# Altium schematic sheet BQ2571x_reference.SchDoc: Title
size C; Engineer: Craig Wenger (cwenger@eesaz.com); Organization: Altium Limited; Address1: L3, 12a Rodborough Rd; Address2: Frenchs Forest; Address3: NSW; Address4: Australia 2086; DocumentNumber: Document Number; Revision: Rev; SheetNumber: X; SheetTotal: Y; ProjectName: Project Name
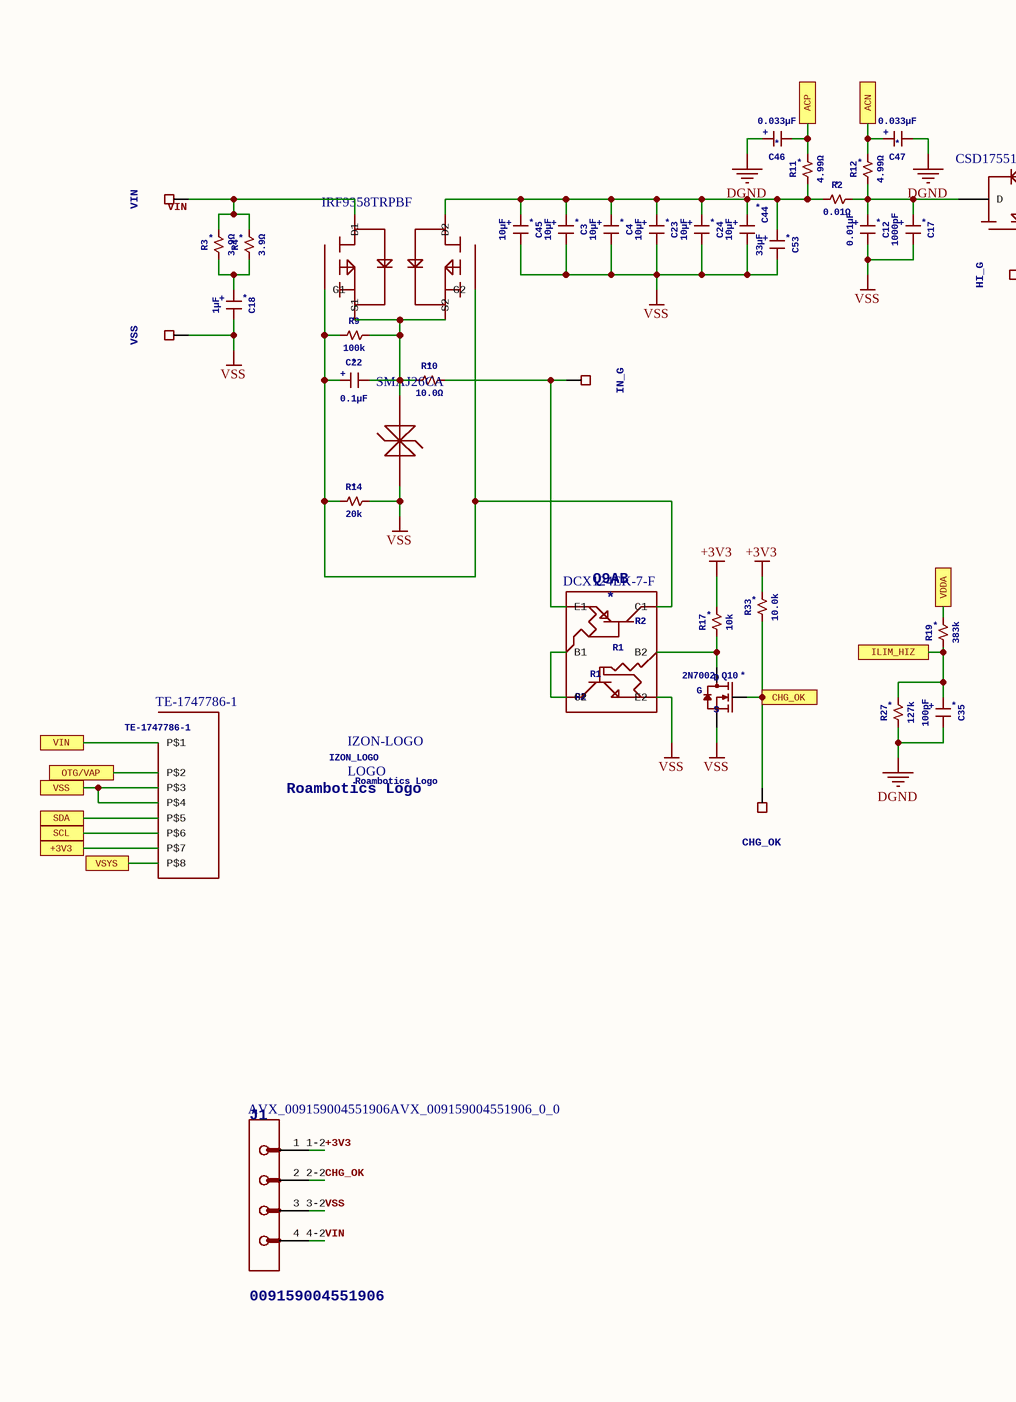
[diagram p0: BQ2571x_reference.SchDoc, left]
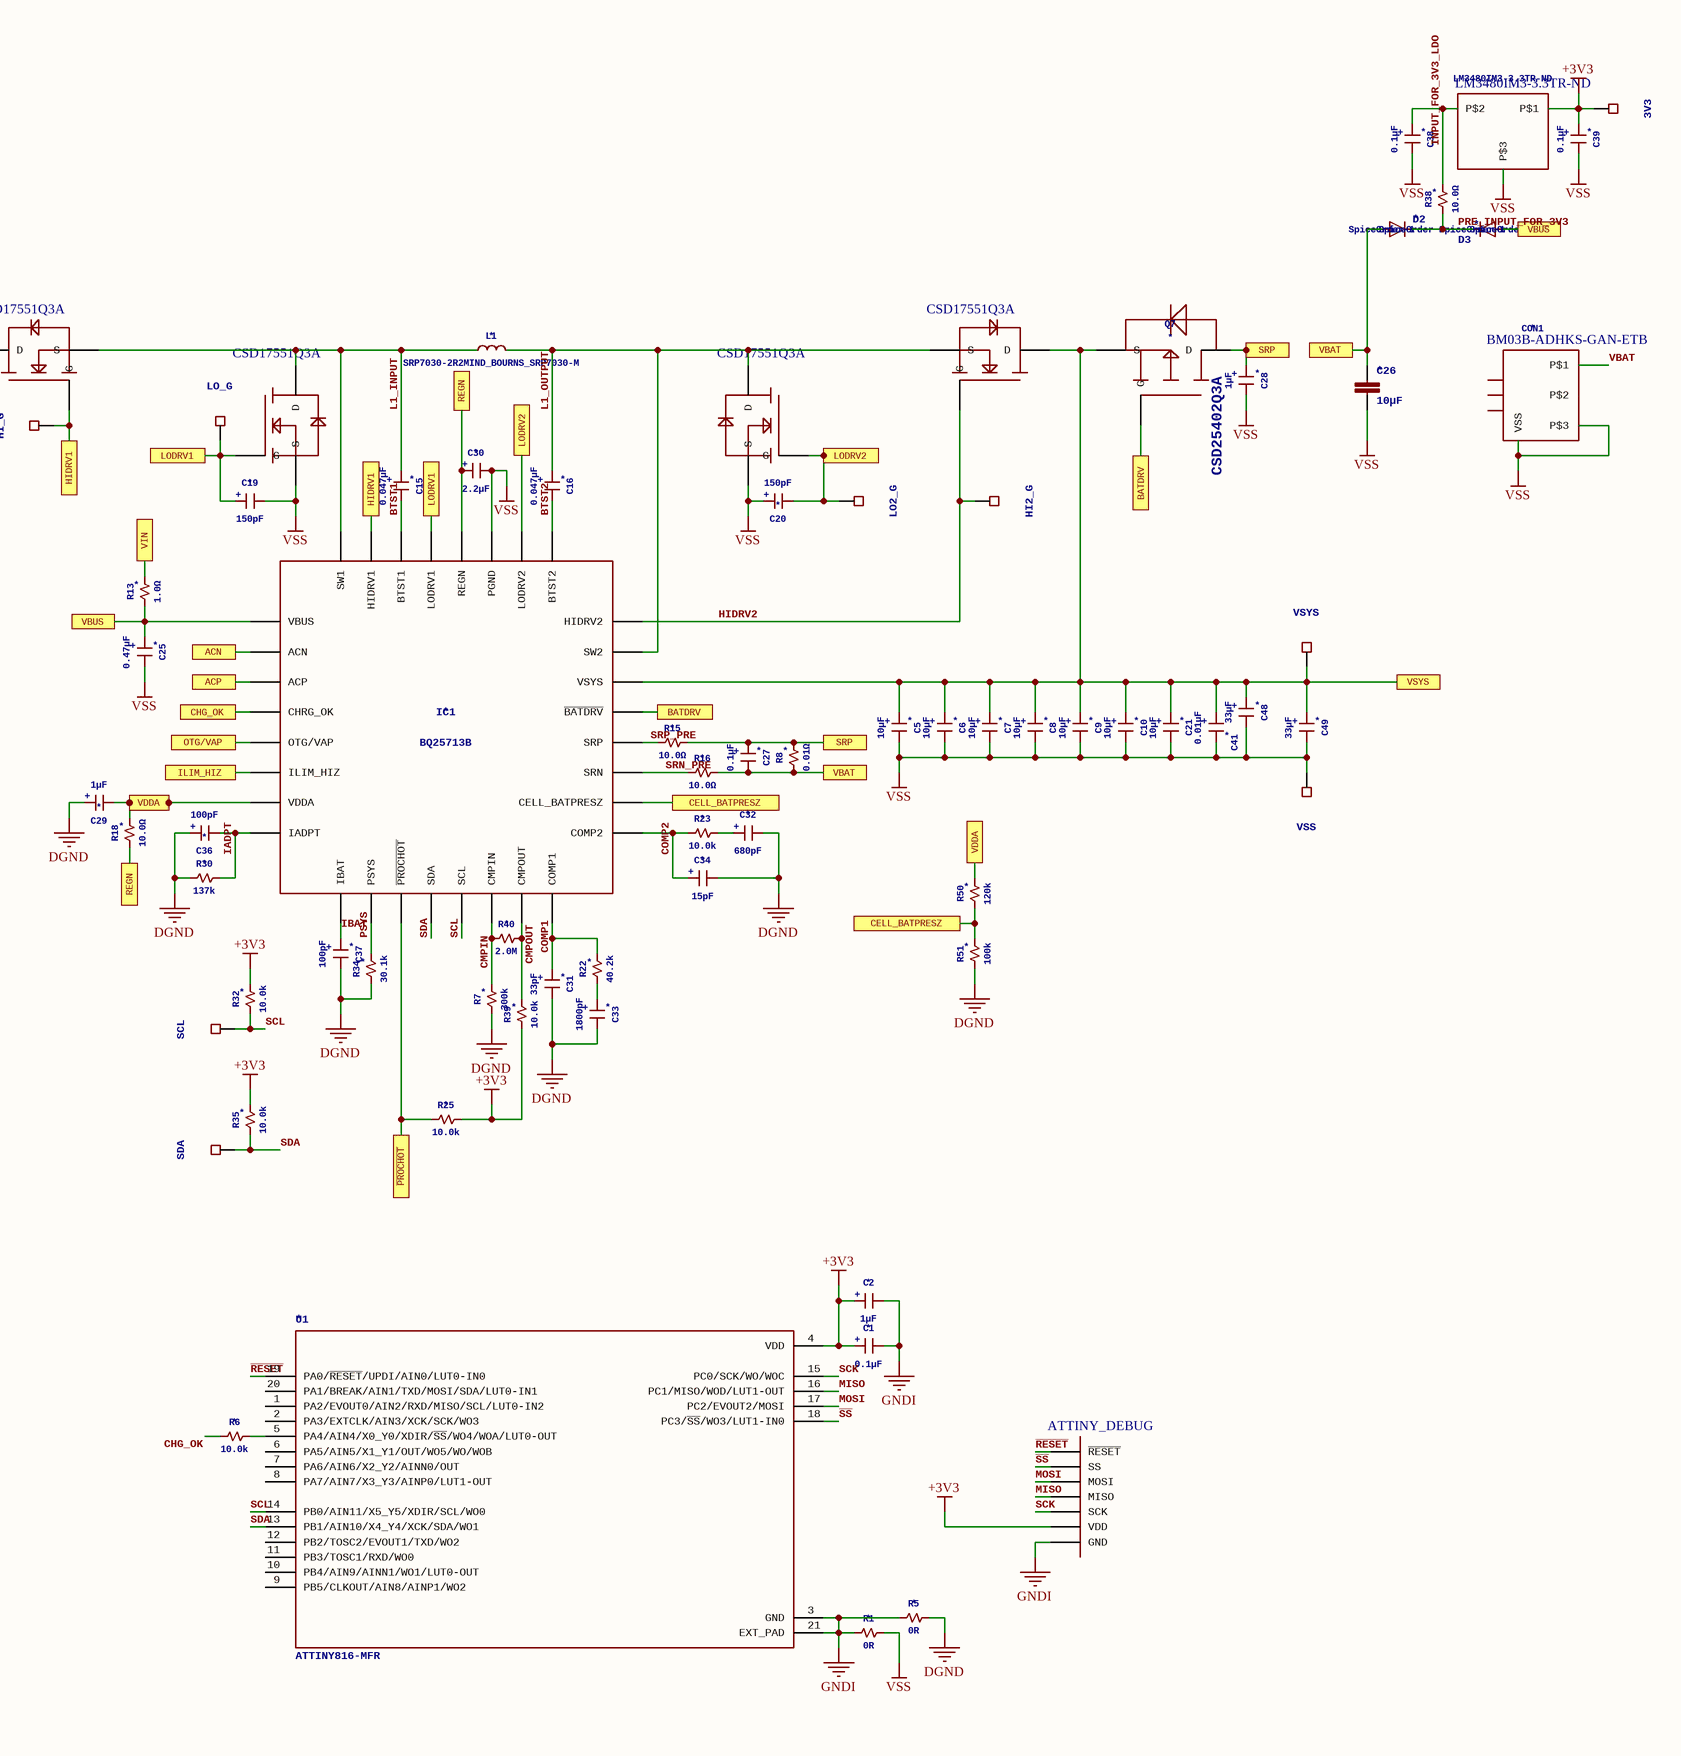
[diagram p1: BQ2571x_reference.SchDoc, right]

## Parts
C1  0.1µF  [0603]
C2  1µF  [0603]
C3  10µF  [0805]
C4  10µF  [0805]
C5  10µF  [0805]
C6  10µF  [0805]
C7  10µF  [0805]
C8  10µF  [0805]
C9  10µF  [0805]
C10  10µF  [0805]
C12  0.01µF  [0603]
C15  0.047µF  [0603]
C16  0.047µF  [0603]
C17  1000pF  [0402]
C18  1µF  [0603]
C19  150pF  [0603]
C20  150pF  [0603]
C21  10µF  [0805]
C22  0.1µF  [0603]
C23  10µF  [0805]
C24  10µF  [0805]
C25  0.47µF  [0805]
C26  10µF  [C1206]
C27  0.1µF  [0603]
C28  1µF  [0603]
C29  1µF  [0603]
C30  2.2µF  [0603]
C31  33pF  [0402]
C32  680pF  [0402]
C33  1800pF  [0402]
C34  15pF  [0402]
C35  100pF  [0603]
C36  100pF  [0603]
C37  100pF  [0603]
C38  0.1µF  [0603]
C39  0.1µF  [0603]
C41  0.01µF  [0603]
C44  10µF  [0805]
C45  10µF  [0805]
C46  0.033µF  [0603]
C47  0.033µF  [0603]
C48  33µF  [1206]
C49  33µF  [1206]
C53  33µF  [1206]
CON1  BM03B-ADHKS-GAN-ETB  [BM03B-ADHKS-GAN-ETB]
CON8  TE-1747786-1  [TE-1747786-1]
D1  SMAJ26CA  [DO-214AC]
D2  SpiceOrder1: SpiceOrder 1  SpiceOrder2: SpiceOrder 2  [SOD323-R]  (hidden comment: DIODE-SOD323-R)
D3  SpiceOrder1: SpiceOrder 1  SpiceOrder2: SpiceOrder 2  [SOD323-R]  (hidden comment: DIODE-SOD323-R)
IC1  BQ25713B  [S-PWQFN-N32]
J1  AVX_009159004551906AVX_009159004551906_0_0  [AVX_009159004551906_0]
L1  SRP7030-2R2MIND_BOURNS_SRP7030-M  [IND_BOURNS_SRP7030-M]
LOGO1  LOGO  RoamboticsLogo: Roambotics Logo  [LOGO]
LOGO4  IZON-LOGO  [IZON_LOGO]
PAD1  3V3  [PAD]
PAD2  VIN  [PAD]
PAD3  VSS  [PAD]
PAD4  CHG_OK  [PAD]
PAD5  SCL  [PAD]
PAD6  SDA  [PAD]
PAD7  VSYS  [PAD]
PAD8  VSS  [PAD]
PAD11  LO2_G  [PAD]
PAD12  IN_G  [PAD]
PAD13  HI_G  [PAD]
PAD14  LO_G  [PAD]
PAD15  HI2_G  [PAD]
Q1  CSD17551Q3A  [TI-Q3A]
Q2  CSD17551Q3A  [TI-Q3A]
Q3  CSD17551Q3A  [TI-Q3A]
Q4  CSD17551Q3A  [TI-Q3A]
Q5-6  IRF9358TRPBF  [INFENION_SO8]
Q7  CSD25402Q3A  [TI-Q3A]
Q9AB  DCX124EK-7-F  [SC-74R]
Q10  2N7002  [SOT-23]
R1  0R  [0402]
R2  0.01Ω  [1206]
R3  3.9Ω  [1206]
R4  3.9Ω  [1206]
R5  0R  [0402]
R6  10.0k  [0402]
R7  300k  [0603]
R8  0.01Ω  [1206]
R9  100k  [0603]
R10  10.0Ω  [1206]
R11  4.99Ω  [0603]
R12  4.99Ω  [0603]
R13  1.0Ω  [0805]
R14  20k  [0603]
R15  10.0Ω  [0603]
R16  10.0Ω  [0603]
R17  10k  [0603]
R18  10.0Ω  [0603]
R19  383k  [0603]
R22  40.2k  [0402]
R23  10.0k  [0402]
R25  10.0k  [0603]
R27  127k  [0603]
R30  137k  [0603]
R32  10.0k  [0603]
R33  10.0k  [0603]
R34  30.1k  [0603]
R35  10.0k  [0603]
R38  10.0Ω  [1206]
R39  10.0k  [0603]
R40  2.0M  [0603]
R50  120k  [0603]
R51  100k  [0603]
U1  ATTINY816-MFR  [QFN40P300X300X90-21N]
U2  LM3480IM3-3.3TR-ND  [SOT−23]
U$1  ATTINY_DEBUG  [ATTINY_DEBUG]

## Ports
+3V3, ACN, ACP, BATDRV, CELL_BATPRESZ, CHG_OK, HIDRV1, ILIM_HIZ, LODRV1, LODRV2, OTG/VAP, REGN, SCL, SDA, SRP, VBAT, VBUS, VDDA, VIN, VSS, VSYS, ~{PROCHOT}

## Nets
+3V3: C1.P$1 C2.P$1 C39.P$1 J1.1_1-2 PAD1.P$1 R17.P$2 R25.P$2 R32.P$2 R33.P$2 R35.P$2 R39.P$1 U1.4(VDD) U2.P$1 U$1.P$2(VDD)
DGND: C29.P$2 C31.P$2 C32.P$2 C33.P$2 C34.P$2 C35.P$2 C36.P$2 C37.P$2 C46.P$2 C47.P$1 R5.P$2 R7.P$1 R27.P$1 R30.P$1 R34.P$1 R51.P$1
GNDI: C1.P$2 C2.P$2 R1.P$1 R5.P$1 U1.3(GND) U1.21(EXT_PAD) U$1.P$1(GND)
VSS: C3.P$2 C4.P$2 C5.P$2 C6.P$2 C7.P$2 C8.P$2 C9.P$2 C10.P$2 C12.P$2 C17.P$2 C18.P$2 C19.P$2 C20.P$2 C21.P$2 C23.P$2 C24.P$2 C25.P$2 C26.2 C28.P$2 C30.P$2 C38.P$2 C39.P$2 C41.P$2 C44.P$2 C45.P$2 C48.P$2 C49.P$2 C53.P$2 CON1.P$3 CON1.P$4_P$5(VSS) D1.P$2 IC1.P$27_P$33(PGND) J1.3_3-2 PAD3.P$1 PAD8.P$1 Q2.P$1_P$2_P$3(S) Q3.P$1_P$2_P$3(S) Q9AB.E2 Q10.2(S) R1.P$2 R14.P$2 U2.P$3
+3V3: CON8.P$7 ; port +3V3  [a separate net that carries the same name]
ACN: C47.P$2 IC1.P$2(ACN) R12.P$2 ; port ACN
ACP: C46.P$1 IC1.P$3(ACP) R11.P$2 ; port ACP
BATDRV: IC1.P$21(~{BATDRV}) Q7.P$4(G) ; port BATDRV
BTST1: C15.P$2 IC1.P$30(BTST1)
BTST2: C16.P$2 IC1.P$25(BTST2)
CELL_BATPRESZ: IC1.P$18(CELL_BATPRESZ) R50.P$1 R51.P$2 ; port CELL_BATPRESZ
CHG_OK: IC1.P$4(CHRG_OK) PAD4.P$1 Q10.1(G) R33.P$1 ; port CHG_OK
CHG_OK: J1.2_2-2 R6.P$1  [a separate net that carries the same name]
CMPIN: IC1.P$14(CMPIN) R7.P$2 R40.P$1
CMPOUT: IC1.P$15(CMPOUT) R39.P$2 R40.P$2
COMP1: C31.P$1 IC1.P$16(COMP1) R22.P$2
COMP2: C34.P$1 IC1.P$17(COMP2) R23.P$1
HIDRV1: IC1.P$31(HIDRV1) PAD13.P$1 Q1.P$4(G) ; port HIDRV1
HIDRV2: IC1.P$24(HIDRV2) PAD15.P$1 Q4.P$4(G)
IADPT: C36.P$1 IC1.P$8(IADPT) R30.P$2
IBAT: C37.P$1 IC1.P$9(IBAT)
ILIM_HIZ: C35.P$1 IC1.P$6(ILIM_HIZ) R19.P$1 R27.P$2 ; port ILIM_HIZ
INPUT_FOR_3V3_LDO: C38.P$1 R38.P$2 U2.P$2
L1_INPUT: C15.P$1 IC1.P$32(SW1) L1.1(P$1) Q1.P$1_P$2_P$3(S) Q2.P$5_P$6_P$7_P$8_P$9(D)
L1_OUTPUT: C16.P$1 IC1.P$23(SW2) L1.2(P$2) Q3.P$5_P$6_P$7_P$8_P$9(D) Q4.P$1_P$2_P$3(S)
LODRV1: C19.P$1 IC1.P$29(LODRV1) PAD14.P$1 Q2.P$4(G) ; port LODRV1
LODRV2: C20.P$1 IC1.P$26(LODRV2) PAD11.P$1 Q3.P$4(G) ; port LODRV2
MISO: U1.16(PC1/MISO/WOD/LUT1-OUT) U$1.P$4(MISO)
MOSI: U1.17(PC2/EVOUT2/MOSI) U$1.P$5(MOSI)
OTG/VAP: CON8.P$2 IC1.P$5(OTG/VAP) ; port OTG/VAP
~{PROCHOT}: IC1.P$11(~{PROCHOT}) R25.P$1 ; port ~{PROCHOT}
PRE_INPUT_FOR_3V3: D2.C D3.C R38.P$1
PSYS: IC1.P$10(PSYS) R34.P$2
~{RESET}: U1.19(PA0/~{RESET}/UPDI/AIN0/LUT0-IN0) U$1.P$7(~{RESET})
REGN: C30.P$1 IC1.P$28(REGN) R18.P$1 ; port REGN
~{SS}: U1.18(PC3/~{SS}/WO3/LUT1-IN0) U$1.P$6(SS)
SCK: U1.15(PC0/SCK/WO/WOC) U$1.P$3(SCK)
SCL: IC1.P$13(SCL) PAD5.P$1 R32.P$1 U1.14(PB0/AIN11/X5_Y5/XDIR/SCL/WO0)
SCL: CON8.P$6 ; port SCL  [a separate net that carries the same name]
SDA: IC1.P$12(SDA) PAD6.P$1 R35.P$1 U1.13(PB1/AIN10/X4_Y4/XCK/SDA/WO1)
SDA: CON8.P$5 ; port SDA  [a separate net that carries the same name]
SRN_PRE: IC1.P$19(SRN) R16.P$1
SRP: C27.P$1 C28.P$1 Q7.P$1_P$2_P$3(D) R8.P$2 R15.P$2 ; port SRP
SRP_PRE: IC1.P$20(SRP) R15.P$1
VBAT: C26.1 C27.P$2 D2.A R8.P$1 R16.P$2 ; port VBAT
VBAT: CON1.P$1  [a separate net that carries the same name]
VBUS: C25.P$1 D3.A IC1.P$1(VBUS) R13.P$1 ; port VBUS
VDDA: C29.P$1 IC1.P$7(VDDA) R18.P$2 R19.P$2 R50.P$2 ; port VDDA
VIN: J1.4_4-2 PAD2.P$1 Q5-6.P$5_P$6(D1) R3.P$2 R4.P$2
VIN: CON8.P$1 R13.P$2 ; port VIN  [a separate net that carries the same name]
VSS: CON8.P$3 CON8.P$4 ; port VSS  [a separate net that carries the same name]
VSYS: C5.P$1 C6.P$1 C7.P$1 C8.P$1 C9.P$1 C10.P$1 C21.P$1 C41.P$1 C48.P$1 C49.P$1 CON8.P$8 IC1.P$22(VSYS) PAD7.P$1 Q4.P$5_P$6_P$7_P$8_P$9(D) Q7.P$5_P$6_P$7_P$8_P$9(S) ; port VSYS
NetC3_P$1: C3.P$1 C4.P$1 C23.P$1 C24.P$1 C44.P$1 C45.P$1 C53.P$1 Q5-6.P$7_P$8(D2) R2.P$1 R11.P$1
NetC12_P$1: C12.P$1 C17.P$1 Q1.P$5_P$6_P$7_P$8_P$9(D) R2.P$2 R12.P$1
NetC18_P$1: C18.P$1 R3.P$1 R4.P$1
NetC22_P$1: C22.P$1 Q5-6.P$2(G2) Q5-6.P$4(G1) Q9AB.C1 R9.P$1 R14.P$1
NetC22_P$2: C22.P$2 D1.P$1 Q5-6.P$1(S2) Q5-6.P$3(S1) R9.P$2 R10.P$1
NetC32_P$1: C32.P$1 R23.P$2
NetC33_P$1: C33.P$1 R22.P$1
NetPAD12_P$1: PAD12.P$1 Q9AB.E1 R10.P$2
NetQ9AB_B1: Q9AB.B1 Q9AB.C2
NetQ9AB_B2: Q9AB.B2 Q10.3(D) R17.P$1
NetR6_P$2: R6.P$2 U1.5(PA4/AIN4/X0_Y0/XDIR/~{SS}/WO4/WOA/LUT0-OUT)

Not connected (* = marked no-connect by the designer): CON1 P$2; U1 1(PA2/EVOUT0/AIN2/RXD/MISO/SCL/LUT0-IN2) 2(PA3/EXTCLK/AIN3/XCK/SCK/WO3) 6(PA5/AIN5/X1_Y1/OUT/WO5/WO/WOB) 7(PA6/AIN6/X2_Y2/AINN0/OUT) 8(PA7/AIN7/X3_Y3/AINP0/LUT1-OUT) 9(PB5/CLKOUT/AIN8/AINP1/WO2) 10(PB4/AIN9/AINN1/WO1/LUT0-OUT) 11(PB3/TOSC1/RXD/WO0) 12(PB2/TOSC2/EVOUT1/TXD/WO2) 20(PA1/BREAK/AIN1/TXD/MOSI/SDA/LUT0-IN1)

## Notes on the sheet
- Title
- Size:
- Date:
- File:
- C
- Number:
- Time:
- Revision:
- Sheet
- of

## Library data of the parts
C1 C2 C12 C15 C16 C18-C20 C22 C27-C30 C35-C39 C41 C46 C47 = SMD_CAP0603: GateName_1: G$1; SymbolName_1: CAPACITOR; DeviceName: 0603; LibraryName: Roambotics; DeviceSetName: SMD_CAP; NAME: *; +: +
C3-C10 C21 C23-C25 C44 C45 = SMD_CAP0805: GateName_1: G$1; SymbolName_1: CAPACITOR; DeviceName: 0805; LibraryName: Roambotics; DeviceSetName: SMD_CAP; NAME: *; +: +
C17 C31-C34 = SMD_CAP0402: GateName_1: G$1; SymbolName_1: CAPACITOR; DeviceName: 0402; LibraryName: Roambotics; DeviceSetName: SMD_CAP; NAME: *; +: +
C26 = C-EUC1206: CAPACITOR, European symbol; GateName_1: G$1; SymbolName_1: C-EU; DeviceName: C1206; LibraryName: rcl; DeviceSetName: C-EU; NAME: *; SPICEPREFIX: C
C48 C49 C53 = SMD_CAP1206: GateName_1: G$1; SymbolName_1: CAPACITOR; DeviceName: 1206; LibraryName: Roambotics; DeviceSetName: SMD_CAP; NAME: *; +: +
CON1 = BM03B-ADHKS-GAN-ETB: GateName_1: G$1; SymbolName_1: BM03B-ADHKS-GAN-ETB; LibraryName: Roambotics; DeviceSetName: BM03B-ADHKS-GAN-ETB; NAME: *
CON8 = TE-1747786-1: GateName_1: G$1; SymbolName_1: TE-1747786-1; LibraryName: Roambotics; DeviceSetName: TE-1747786-1; TE-1747786-1: TE-1747786-1
D1 = SMAJ26CA: GateName_1: G$1; SymbolName_1: BI_ZENER_TVS; LibraryName: Roambotics; DeviceSetName: SMAJ26CA
D2 D3 = DIODE-SOD323-R: DIODE; GateName_1: G$1; SymbolName_1: D; DeviceSetName: DIODE-; DeviceName: SOD323-R; LibraryName: diode; NAME: *
IC1 = BQ25713B: GateName_1: G$1; SymbolName_1: BQ25713B; LibraryName: Roambotics; DeviceSetName: BQ25713B; NAME: *
J1 = AVX_009159004551906AVX_009159004551906_0_0: SSL Connector 4 Position Receptacle Board to Board - Card Edge 0.079" (2.00mm) Solder; GateName_1: G$0; CENTROID_NOT_SPECIFIED: No; IS_FEMALE: yes; MF: AVX; PREFIX: J; TEMPERATURE_RANGE_HIGH: +120°C; TEMPERATURE_RANGE_LOW: -40°C; VOLTAGE: 300V; SymbolName_1: AVX_009159004551906_0_0; DeviceName: AVX_009159004551906_0_0; LibraryName: Roambotics Bullshit Managed Library; DeviceSetName: AVX_009159004551906; DATASHEET: https://upverter.com/datasheet/7aa983046cb5748ce24acf07799eb32d6dc4037e.pdf; DIGIKEY_DESCRIPTION: CONN SSL RCPT 4POS 2MM SOLDER; DIGIKEY_PART_NUMBER: 478-8738-1-ND; LEAD_FREE: yes; MFG_PACKAGE_IDENT: *; MOUSER_PART_NUMBER: 581-009159004551906; MPN: 009159004551906; NAME: *; PACKAGE: CONN_SMD; ROHS: yes; 009159004551906: 009159004551906
L1 = SRP7030-2R2MIND_BOURNS_SRP7030-M: MANUFACTURER_PART_NUMBER: SRP70302R2M; GateName_1: A; SymbolName_1: INDUCTOR_MK2; VENDOR: Bourns Electronics; DeviceName: IND_BOURNS_SRP7030-M; LibraryName: Roambotics; DeviceSetName: SRP7030-2R2M; NAME: *
LOGO1 = LOGO: GateName_1: G$1; SymbolName_1: LOGO; LibraryName: Roambotics; DeviceSetName: LOGO
LOGO4 = IZON-LOGO: GateName_1: G$1; SymbolName_1: IZON_LOGO; LibraryName: Roambotics; DeviceSetName: IZON-LOGO; IZON_LOGO: IZON_LOGO
PAD1-PAD8 PAD11-PAD15 = 1X1_PAD: GateName_1: G$1; SymbolName_1: TEST_PAD; LibraryName: Roambotics; DeviceSetName: 1X1_PAD
Q1-Q4 = CSD17551Q3A: GateName_1: G$1; SymbolName_1: N-CHANNEL_MOSFET; LibraryName: Roambotics; DeviceSetName: CSD17551Q3A
Q5-6 = IRF9358TRPBF: GateName_1: G$1; SymbolName_1: DUAL_P-MOSFET; LibraryName: Roambotics; DeviceSetName: IRF9358TRPBF
Q7 = CSD25402Q3A: GateName_1: G$1; SymbolName_1: P-CHANNEL_MOSFET; LibraryName: Roambotics; DeviceSetName: CSD25402Q3A; NAME: *
Q9AB = DCX124EK-7-F: GateName_1: G$1; SymbolName_1: DCX124EK-7-F; LibraryName: Roambotics; DeviceSetName: DCX124EK-7-F; NAME: *; R1: R1; R2: R2
Q10 = SMD-MOSFET-N-CH-60V-300MA-LOGIC-LEVEL-FET-2N7002(SOT-23): 305030028; MPN: 2N7002,215; GateName_1: G$1; SymbolName_1: MOSFET-N; LibraryName: Seeed-Transistor; DeviceSetName: SMD-MOSFET-N-CH-60V-300MA-LOGIC-LEVEL-FET-2N7002(SOT-23); NAME: *; D: D; S: S; G: G
R1 R5 R6 R22 R23 = SMD_RES0402: GateName_1: G$1; SymbolName_1: RESISTOR; DeviceName: 0402; LibraryName: Roambotics; DeviceSetName: SMD_RES; NAME: *
R2-R4 R8 R10 R38 = SMD_RES1206: GateName_1: G$1; SymbolName_1: RESISTOR; DeviceName: 1206; LibraryName: Roambotics; DeviceSetName: SMD_RES; NAME: *
R7 R9 R11 R12 R14-R19 R25 R27 R30 R32-R35 R39 R40 R50 R51 = SMD_RES0603: GateName_1: G$1; SymbolName_1: RESISTOR; DeviceName: 0603; LibraryName: Roambotics; DeviceSetName: SMD_RES; NAME: *
R13 = SMD_RES0805: GateName_1: G$1; SymbolName_1: RESISTOR; DeviceName: 0805; LibraryName: Roambotics; DeviceSetName: SMD_RES; NAME: *
U1 = ATTINY816-MFR: Mcu, 8bit, Pic24fj, 20mhz, Qfn-20; GateName_1: G$1; MF: Microchip; SymbolName_1: ATTINY816-MFR; LibraryName: ATTINY816-MFR; DeviceSetName: ATTINY816-MFR; DIGI-KEY_PART_NUMBER: ATTINY816-MFRCT-ND; DIGI-KEY_PURCHASE_URL: https://www.digikey.com/product-detail/en/microchip-technology/ATTINY816-MFR/ATTINY816-MFRCT-ND/6556166?utm_source=snapeda&utm_medium=aggregator&utm_campaign=symbol; MP: ATTINY816-MFR; NAME: *; PACKAGE: QFN-20 Microchip
U2 = LM3480IM3-3.3TR-ND: GateName_1: G$1; SymbolName_1: LM3480IM3-3.3TR-ND; LibraryName: Roambotics; DeviceSetName: LM3480IM3-3.3TR-ND; LM3480IM3-3.3TR-ND: LM3480IM3-3.3TR-ND
U$1 = ATTINY_DEBUG: GateName_1: G$1; SymbolName_1: ATTINY_DEBUG; LibraryName: Roambotics; DeviceSetName: ATTINY_DEBUG